# EAGLE design ottoesp_wrover (EAGLE 9.6.2)
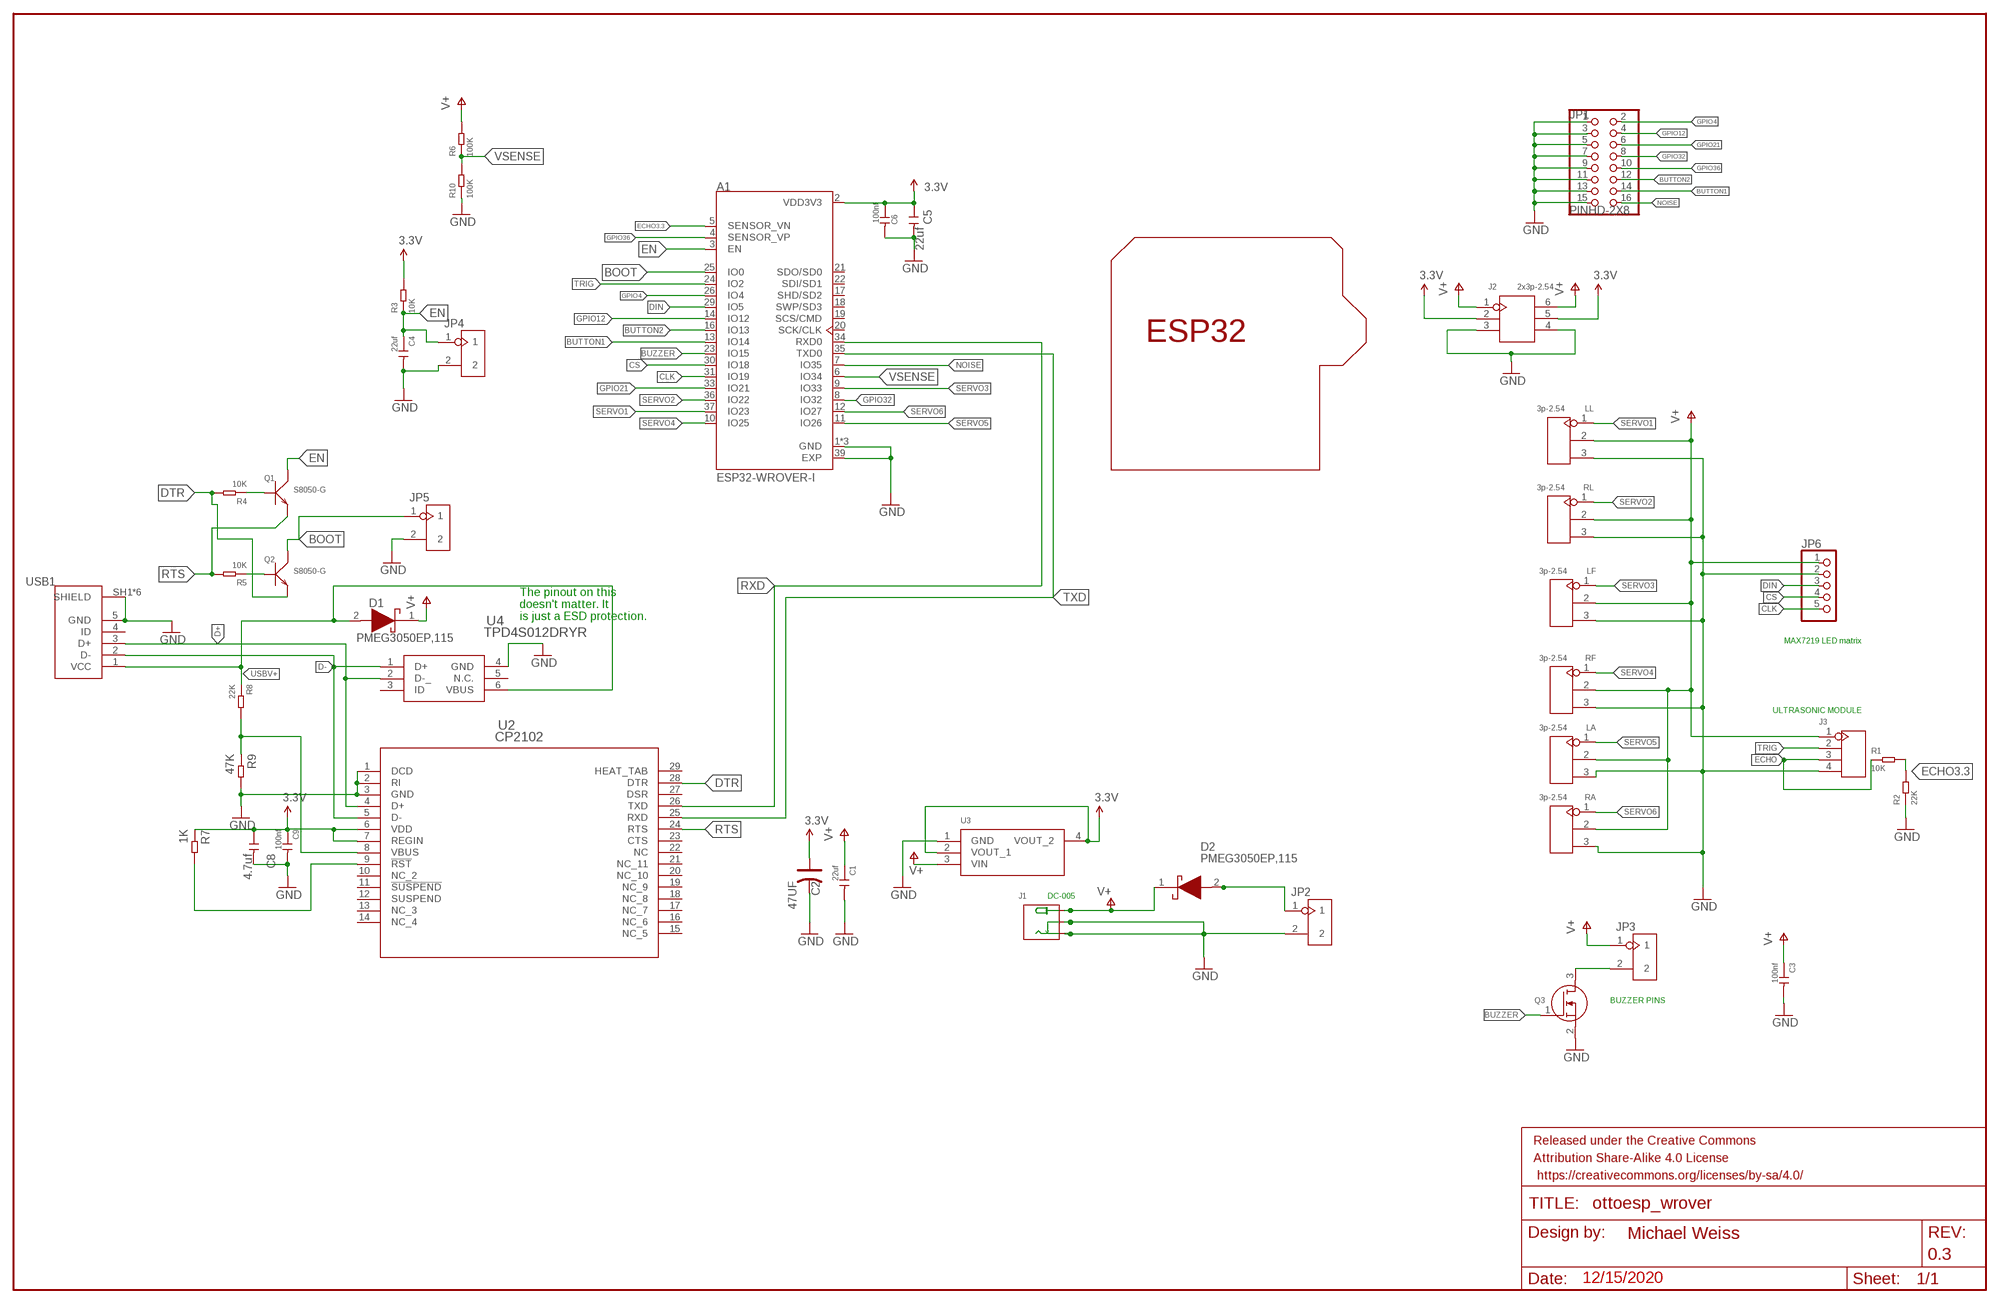
[diagram p0: schematic, sheet 1]

## Parts
A1  ESP32-WROVER-I  [XCVR_ESP32-WROVER-I]
C1  22uf  CERAMIC-22UF-6.3V-20%-X5R(0805)  [C0805]
C2  47UF  ALUMINUM-SMD-47UF-25V(D6.3-H5.3MM)  [ELECTRO-SMD-C-6MM]
C3  100nf  CERAMIC-100NF-50V-20%-X5R(0805)  [C0805]
C4  22uf  CERAMIC-22UF-6.3V-20%-X5R(0805)  [C0805]
C5  22uf  CERAMIC-22UF-6.3V-20%-X5R(0805)  [C0805]
C6  100nf  CERAMIC-100NF-50V-20%-X5R(0805)  [C0805]
C8  4.7uf  CERAMIC-4.7UF-25V-10%-X5R(0805)  [C0805]
C9  100nf  CERAMIC-100NF-50V-20%-X5R(0805)  [C0805]
D1  PMEG3050EP,115  [PMEG3050EP115]
D2  PMEG3050EP,115  [PMEG3050EP115]
FRAME1  FRAME-LEDGERMISHAFARMS  [MISHAFARMS]
J1  DC-005  CONN-POWER-JACK-2.1MM(DC-005)  [DCJ3P-14.2X11.0X9.0MM]
J2  2x3p-2.54  DIP-BLACK-MALE-HEADER(2X3P-2.54）-2.54  [H2X3-2.54]
J3  4p-2.54  DIP-BLACK-MALE-HEADER-VERT(4P-2.54)  [H4-2.54]
JP1  PINHD-2X8  [2X08]
JP2  2p-2.54  DIP-BLACK-MALE-HEADER-VERT(2P-2.54)  [H2-2.54]
JP3  2p-2.54  DIP-BLACK-MALE-HEADER-VERT(2P-2.54)  [H2-2.54]
JP4  2p-2.54  DIP-BLACK-MALE-HEADER-VERT(2P-2.54)  [H2-2.54]
JP5  2p-2.54  DIP-BLACK-MALE-HEADER-VERT(2P-2.54)  [H2-2.54]
JP6  PINHD-1X5  [1X05]
LA  3p-2.54  DIP-BLACK-MALE-HEADER-VERT(3P-2.54)  [H3-2.54]
LF  3p-2.54  DIP-BLACK-MALE-HEADER-VERT(3P-2.54)  [H3-2.54]
LL  3p-2.54  DIP-BLACK-MALE-HEADER-VERT(3P-2.54)  [H3-2.54]
Q1  S8050-G  SMD-TRANSISTORS-NPN-25V-500MW-S8050(SOT-23)  [SOT-23]
Q2  S8050-G  SMD-TRANSISTORS-NPN-25V-500MW-S8050(SOT-23)  [SOT-23]
Q3  CJ2302  2N7002NXAKR  [SOT95P230X110-3N]
R1  10K  SMD-RES-10K-1%-1/4W(0805)  [R0805]
R2  22K  SMD-RES-22K-5%-1/4W(0805)  [R0805]
R3  10K  SMD-RES-10K-1%-1/4W(0805)  [R0805]
R4  10K  SMD-RES-10K-1%-1/4W(0805)  [R0805]
R5  10K  SMD-RES-10K-1%-1/4W(0805)  [R0805]
R6  100K  SMD-RES-100K-.5%-1/10W(0805)  [R0805]
R7  1K  SMD-RES-1K-1%-1/8W(0805)  [R0805]
R8  22K  SMD-RES-22K-5%-1/4W(0805)  [R0805]
R9  47K  SMD-RES-47K-1%-1/4W(0805)  [R0805]
R10  100K  SMD-RES-100K-.5%-1/10W(0805)  [R0805]
RA  3p-2.54  DIP-BLACK-MALE-HEADER-VERT(3P-2.54)  [H3-2.54]
RF  3p-2.54  DIP-BLACK-MALE-HEADER-VERT(3P-2.54)  [H3-2.54]
RL  3p-2.54  DIP-BLACK-MALE-HEADER-VERT(3P-2.54)  [H3-2.54]
U2  CP2102  [QFN28N5X5-0P5P]
U3  CJA1117B-3.3-SOT89  AP2114H-3.3TRG1  [SOT230P700X180-4N]
U4  TPD4S012DRYR  [TPD4S012DRYR]
U$2  ESP32_SHIELDSMALL  [ESP32_ARDUINOSHIELDSMALL]
USB1  ZX62-B-5PA  ZX62-B-5PA(33)  [HRS_ZX62-B-5PA(33)]

## Nets
3.3V [3.3V]: A1.2(VDD3V3) C2.+ C5.1 C6.1 C8.1 C9.1 J2.2 J2.5 R3.2 R7.1 U2.6(VDD) U2.7(REGIN) U3.2(VOUT_1) U3.4(VOUT_2)
BOOT: A1.25(IO0) JP5.1 Q2.3(C)
BUTTON1: A1.13(IO14) JP1.14
BUTTON2: A1.16(IO13) JP1.12
BUZZER: A1.23(IO15) Q3.1(G)
CLK: A1.31(IO19) JP6.5
CS: A1.30(IO18) JP6.4
D+: U2.4(D+) U4.2(D-_) USB1.3(D+)
D-: U2.5(D-) U4.1(D+) USB1.2(D-)
DIN: A1.29(IO5) JP6.3
DTR: Q2.2(E) R4.2 U2.28(DTR)
ECHO: J3.3 R1.1
ECHO3.3: A1.5(SENSOR_VN) R1.2 R2.2
EN: A1.3(EN) C4.1 JP4.1 Q1.3(C) R3.1
GND: A1.1(GND) A1.15(GND) A1.38(GND) A1.39(EXP) C1.2 C2.- C3.2 C4.2 C5.2 C6.2 C8.2 C9.2 J1.-1B(-) J1.-1T(-) J1.-2(CDN) J1.-2B(CDN) J2.3 J2.4 J3.4 JP1.1 JP1.3 JP1.5 JP1.7 JP1.9 JP1.11 JP1.13 JP1.15 JP2.2 JP4.2 JP5.2 JP6.2 LA.3 LF.3 LL.3 Q3.2(S) R2.1 R9.2 R10.1 RA.3 RF.3 RL.3 U2.1(DCD) U2.2(RI) U2.3(GND) U3.1(GND) U4.4(GND) USB1.5(GND) USB1.SH1(SHIELD) USB1.SH2(SHIELD) USB1.SH3(SHIELD) USB1.SH4(SHIELD) USB1.SH5(SHIELD) USB1.SH6(SHIELD)
GPIO4: A1.26(IO4) JP1.2
GPIO12: A1.14(IO12) JP1.4
GPIO21: A1.33(IO21) JP1.6
GPIO32: A1.8(IO32) JP1.8
GPIO36: A1.4(SENSOR_VP) JP1.10
N$3: JP3.2 Q3.3(D)
N$4: Q1.1(B) R4.1
N$5: Q2.1(B) R5.1
N$6: R7.2 U2.9(!RST)
N$7: R8.2 R9.1 U2.8(VBUS)
N$11 [V+]: D2.2(A) JP2.1
NOISE: A1.7(IO35) JP1.16
RTS: Q1.2(E) R5.2 U2.24(RTS)
RXD: A1.34(RXD0) U2.26(TXD)
SERVO1: A1.37(IO23) LL.1
SERVO2: A1.36(IO22) RL.1
SERVO3: A1.9(IO33) LF.1
SERVO4: A1.10(IO25) RF.1
SERVO5: A1.11(IO26) LA.1
SERVO6: A1.12(IO27) RA.1
TRIG: A1.24(IO2) J3.2
TXD: A1.35(TXD0) U2.25(RXD)
USBV+: D1.2(A) R8.1 U4.6(VBUS) USB1.1(VCC)
V+ [V+]: C1.1 C3.1 D1.1(K) D2.1(K) J1.+B(+) J1.+T(+) J2.1 J2.6 J3.1 JP3.1 JP6.1 LA.2 LF.2 LL.2 R6.2 RA.2 RF.2 RL.2 U3.3(VIN)
VSENSE: A1.6(IO34) R6.1 R10.2
Unconnected: A1.17(SHD/SD2) A1.18(SWP/SD3) A1.19(SCS/CMD) A1.20(SCK/CLK) A1.21(SDO/SD0) A1.22(SDI/SD1) U2.10(NC_2) U2.11(!SUSPEND) U2.12(SUSPEND) U2.13(NC_3) U2.14(NC_4) U2.15(NC_5) U2.16(NC_6) U2.17(NC_7) U2.18(NC_8) U2.19(NC_9) U2.20(NC_10) U2.21(NC_11) U2.22(NC) U2.23(CTS) U2.27(DSR) U2.29(HEAT_TAB) U4.3(ID) U4.5(N.C.) USB1.4(ID)

## Notes on the sheet
- The pinout on this
  doesn't matter. It
  is just a ESD protection.
- MAX7219 LED matrix
- ULTRASONIC MODULE
- BUZZER PINS
- 12/15/2020

## Library data of the parts
A1 = SamacSys_Parts:ESP32-WROVER-I: ESP32 WROVER-IB; DESCRIPTION: ESP-32 WROVER; MANUFACTURER_NAME: Espressif Systems; MANUFACTURER_PART_NUMBER: ESP32-WROVER-IE(M213EH2864UH3Q0); MOUSER_PART_NUMBER: 356-ESP32WRVIE2864UC; MOUSER_PRICE-STOCK: https://www.mouser.com/ProductDetail/Espressif-Systems/ESP32-WROVER-IEM213EH2864UH3Q0/?qs=%2Fha2pyFadugKGKyA%252BZerg02KWjt%252BDkpx3J9PekcVrnwUVjlziX0fZwpevaFLQ9DtOpRR%252BtWJ7uE%3D
C1 C4 C5 = SamacSys_Parts:CERAMIC-22UF-6.3V-20%-X5R(0805): Capacitor 22uf 20% SMD 0805; DESCRIPTION: Capacitor 22uf 20% SMD 0805; MANUFACTURER_NAME: KEMET; MANUFACTURER_PART_NUMBER: C1206C226M9PACTU; MOUSER_PART_NUMBER: 80-C1206C226M9P; MOUSER_PRICE-STOCK: https://www.mouser.com/ProductDetail/KEMET/C1206C226M9PACTU/?qs=e7A2guvi5TDfGn1mCprQAw%3D%3D
C2 = SamacSys_Parts:ALUMINUM-SMD-47UF-25V(D6.3-H5.3MM): Electrolytic Capacitors - SMD 25 Volts 47uF 20% 6.3x5.3; DESCRIPTION: Electrolytic Capacitors - SMD 25 Volts 47uF 20% 6.3x5.3; MANUFACTURER_NAME: Lelon; MANUFACTURER_PART_NUMBER: VE-470M1ETR-0605; MOUSER_PART_NUMBER: 140-VE470M1ETR0605; MOUSER_PRICE-STOCK: https://www.mouser.com/ProductDetail/Lelon/VE-470M1ETR-0605/?qs=%2Fha2pyFadujyJfKDrJB4ynLbAx5NeyBtku0SVNtXu37UWxAjl85WnQ%3D%3D
C3 C6 C9 = SamacSys_Parts:CERAMIC-100NF-50V-20%-X5R(0805): Capacitor 100nf 20% SMD 0805; DESCRIPTION: Capacitor 100nf 20% SMD 0805; MANUFACTURER_NAME: Yageo; MANUFACTURER_PART_NUMBER: CC0805ZRY5V9BB104; MOUSER_PART_NUMBER: 603-CC805ZRY5V9BB104; MOUSER_PRICE-STOCK: https://www.mouser.com/ProductDetail/Yageo/CC0805ZRY5V9BB104/?qs=%2Fha2pyFaduhNpscxq1sti0Qw6N3MgEmHt2LRq9SOD7Ebj2OJEh4r7aJUxnG3Kkh7
C8 = SamacSys_Parts:CERAMIC-4.7UF-25V-10%-X5R(0805): 302010146; DESCRIPTION: Capacitor 4.7uf 10% SMD 0805; MANUFACTURER_NAME: Walsin; MANUFACTURER_PART_NUMBER: 0805X475M250CT; MOUSER_PART_NUMBER: 791-0805X475M250CT; MOUSER_PRICE-STOCK: https://www.mouser.com/ProductDetail/Walsin/0805X475M250CT/?qs=%2Fha2pyFadugovbtJ4IPO2aI5%2FHfN6czWOLxzJ368rfolfgZFQZPK8JJR9MicoCMy
D1 D2 = SamacSys_Parts:PMEG3050EP,115: NXP PMEG3050EP,115 SMT Schottky Diode, 30V 5A, 2-Pin SOD-128 Source: Datasheet; DESCRIPTION: NXP PMEG3050EP,115 SMT Schottky Diode, 30V 5A, 2-Pin SOD-128; HEIGHT: 1mm; MANUFACTURER_NAME: Nexperia; MANUFACTURER_PART_NUMBER: PMEG3050EP,115; MOUSER_PART_NUMBER: 771-PMEG3050EP115; MOUSER_PRICE-STOCK: https://www.mouser.co.uk/ProductDetail/Nexperia/PMEG3050EP115?qs=GcY6OjH1zdmnjQ%2FhUT5aOA%3D%3D
FRAME1 = SamacSys_Parts:FRAME-LEDGER: Schematic Frame - Ledger Standard 11x14 US Ledger frame; DESIGNER: Michael Weiss; REV: 0.3
J1 = OPL_Connector:CONN-POWER-JACK-2.1MM(DC-005): Seeed SKU 320120003 - DIP Black DC Jack 2.1MM MPN: DC-005 Important Notes: This part requires milling slots. Please make sure layer 46 Milling is included in the profile or outline layer when exporting Gerber files. Alternatively, you can use the built-in Seeed Fusion CAM file. Find it under Third-Party CAM files. Seeed Fusion PCBA OPL <https://www.seeedstudio.com/opl.html> Order PCB/PCBA Now <https://www.seeedstudio.com/fusion_pcb.html> www.seeedstudio.com; MPN: DC-005
J2 = SamacSys_Parts:DIP-BLACK-MALE-HEADER(2X3P-2.54）: 320020077; MANUFACTURER_PART_NUMBER: P125-12A1BS116A1
J3 = SamacSys_Parts:DIP-BLACK-MALE-HEADER-VERT(4P-2.54): 320020017; MANUFACTURER_PART_NUMBER: P125-1104A0BS116A1
JP1 = Connector:PINHD-2X8: PIN HEADER; CATEGORY: CONNECTOR; SUB-CATEGORY: PIN-HEADER
JP2-JP5 = SamacSys_Parts:DIP-BLACK-MALE-HEADER-VERT(2P-2.54): 320020016; MANUFACTURER_PART_NUMBER: P125-1102A0BS116A1
JP6 = SamacSys_Parts:PINHD-1X5: PIN HEADER
LA LF LL RA RF RL = SamacSys_Parts:DIP-BLACK-MALE-HEADER-VERT(3P-2.54): 320020079
Q1 Q2 = SamacSys_Parts:SMD-TRANSISTORS-NPN-25V-500MW-S8050(SOT-23): NPN transistor; MANUFACTURER_PART_NUMBER: SS8050-G; MOUSER_PART_NUMBER: 750-SS8050-G
Q3 = SamacSys_Parts:2N7002NXAKR: NEXPERIA - 2N7002NXAKR - MOSFET Transistor, Trench, N Channel, 190 mA, 60 V, 3 ohm, 10 V, 1.6 V Source: Datasheet; DESCRIPTION: NEXPERIA - 2N7002NXAKR - MOSFET Transistor, Trench, N Channel, 190 mA, 60 V, 3 ohm, 10 V, 1.6 V; HEIGHT: 1.1mm; MANUFACTURER_NAME: Nexperia; MANUFACTURER_PART_NUMBER: 2N7002NXAKR; MOUSER_PART_NUMBER: 771-2N7002NXAKR; MOUSER_PRICE-STOCK: https://www.mouser.co.uk/ProductDetail/Nexperia/2N7002NXAKR/?qs=%252B6g0mu59x7JoAsZYPFXqhw%3D%3D
R1 R3-R5 = SamacSys_Parts:SMD-RES-10K-1%-1/4W(0805): Resistor 10K 1%; DESCRIPTION: Resistor 10K 1% SMD 0805; MANUFACTURER_NAME: KOA Speer; MANUFACTURER_PART_NUMBER: RK73H2ATTD1002F; MOUSER_PART_NUMBER: 660-RK73H2ATTD1002F; MOUSER_PRICE-STOCK: https://www.mouser.com/ProductDetail/KOA-Speer/RK73H2ATTD1002F/?qs=tLTLU8dkiwvc%2FyU3ERoqnw%3D%3D
R2 R8 = SamacSys_Parts:SMD-RES-22K-5%-1/4W(0805): Resistor 22K 5%; DESCRIPTION: Resistor 22K 5% SMD 0805; MANUFACTURER_NAME: KOA Speer; MANUFACTURER_PART_NUMBER: RK73B2ATTD223J; MOUSER_PART_NUMBER: 660-RK73B2ATTD223J; MOUSER_PRICE-STOCK: https://www.mouser.com/ProductDetail/KOA-Speer/RK73B2ATTD223J/?qs=rx%252BqewZzWUffEp6AgUqu%252Bg%3D%3D
R6 R10 = SamacSys_Parts:SMD-RES-100K-.5%-1/10W(0805): Resistor 100K 0.5%; DESCRIPTION: Resistor 100K 0.5% SMD 0805; MANUFACTURER_NAME: Susumu; MANUFACTURER_PART_NUMBER: RR1220P-104-D; MOUSER_PART_NUMBER: 754-RR1220P-104D; MOUSER_PRICE-STOCK: https://www.mouser.com/ProductDetail/Susumu/RR1220P-104-D/?qs=%2Fha2pyFadujCPgNeBjWI96%252BroUq1pkWN2MbsYos73Tx95ayAVluOxg%3D%3D
R7 = SamacSys_Parts:SMD-RES-1K-1%-1/8W(0805): Resistor 1K 1%; DESCRIPTION: Resistor 1K 1% SMD 0805; MANUFACTURER_NAME: Vishay / Dale; MANUFACTURER_PART_NUMBER: CRCW08051K00FKEAC; MOUSER_PART_NUMBER: 71-CRCW08051K00FKEAC; MOUSER_PRICE-STOCK: https://www.mouser.com/ProductDetail/Vishay-Dale/CRCW08051K00FKEAC/?qs=%2Fha2pyFadui6t5gBae62od441kk8GmyGFVmxEidNFq5xUBgAyCVXXx2D0V55RqKK
R9 = SamacSys_Parts:SMD-RES-47K-1%-1/4W(0805): Resistor 47K 1%; DESCRIPTION: Resistor 47K 1% SMD 0805; MANUFACTURER_NAME: KOA Speer; MANUFACTURER_PART_NUMBER: RK73H2ATTD4702F; MOUSER_PART_NUMBER: 660-RK73H2ATTD4702F; MOUSER_PRICE-STOCK: https://www.mouser.com/ProductDetail/KOA-Speer/RK73H2ATTD4702F/?qs=%2Fha2pyFadujLLpodnepgt4r0Qw%2FLlQaBaDxSVsal6zzxootuMZ88MQ%3D%3D
U2 = SamacSys_Parts:CP2102: USB to UART; DESCRIPTION: USB-UART; MANUFACTURER_NAME: Silicon Labs; MANUFACTURER_PART_NUMBER: CP2102N-A02-GQFN28R; MOUSER_PART_NUMBER: 634-CP2102NA02QFN28R; MOUSER_PRICE-STOCK: https://www.mouser.com/ProductDetail/Silicon-Labs/CP2102N-A02-GQFN28R/?qs=u16ybLDytRag4qKvSH3fTw%3D%3D
U3 = SamacSys_Parts:AP2114H-3.3TRG1: 1A 3.3V Low Noise LDO Regulator SOT223 DiodesZetex AP2114H-3.3TRG1, LDO Voltage Regulator, 1 (Min)A, 3.3 V +/-1.5%, 2.5 6 Vin, 3-Pin SOT-223 Source: Datasheet; DESCRIPTION: 1A 3.3V Low Noise LDO Regulator SOT223 DiodesZetex AP2114H-3.3TRG1, LDO Voltage Regulator, 1 (Min)A, 3.3 V +/-1.5%, 2.5 6 Vin, 3-Pin SOT-223; HEIGHT: 1.8mm; MANUFACTURER_NAME: Diodes Inc.; MANUFACTURER_PART_NUMBER: AP2114H-3.3TRG1; MOUSER_PART_NUMBER: 621-AP2114H-3.3TRG1; MOUSER_PRICE-STOCK: https://www.mouser.co.uk/ProductDetail/Diodes-Incorporated/AP2114H-33TRG1?qs=x6A8l6qLYDDSG%2FfwzcsOhw%3D%3D
U4 = SamacSys_Parts:TPD4S012DRYR: ESD Suppressors / TVS Diodes 4Ch USB ESD Solution w/ Pwr Clamp Source: Datasheet <https://www.ti.com/lit/gpn/TPD4S012>; DESCRIPTION: ESD Suppressors / TVS Diodes 4Ch USB ESD Solution w/ Pwr Clamp; HEIGHT: 0.6mm; MANUFACTURER_NAME: Texas Instruments; MANUFACTURER_PART_NUMBER: TPD4S012DRYR; MOUSER_PART_NUMBER: 595-TPD4S012DRYR; MOUSER_PRICE-STOCK: https://www.mouser.co.uk/ProductDetail/Texas-Instruments/TPD4S012DRYR?qs=XGzIaZb%2FFYJve%2FbrCpoVgg%3D%3D
U$2 = ottoesp:ESP32_SHIELDSMALL: Board pattern for Otto
USB1 = SamacSys_Parts:ZX62-B-5PA(33): ZX Series 5 Position Right Angle PCB Wire Micro B USB Plug; DESCRIPTION: USB Micro B female connector; MANUFACTURER_NAME: Hirose Connector; MANUFACTURER_PART_NUMBER: ZX62-B-5PA(33); MOUSER_PART_NUMBER: 798-ZX62-B-5PA33; MOUSER_PRICE-STOCK: https://www.mouser.com/ProductDetail/Hirose-Connector/ZX62-B-5PA33/?qs=%2Fha2pyFaduhiSQl2TrshNN4h5tYLcCq4%252B%2FDj%2FzhIV4TUsZmrT6v6qg%3D%3D

## Net classes
1 3.3V: width 0.406 mm
2 V+: width 1.016 mm

## Board
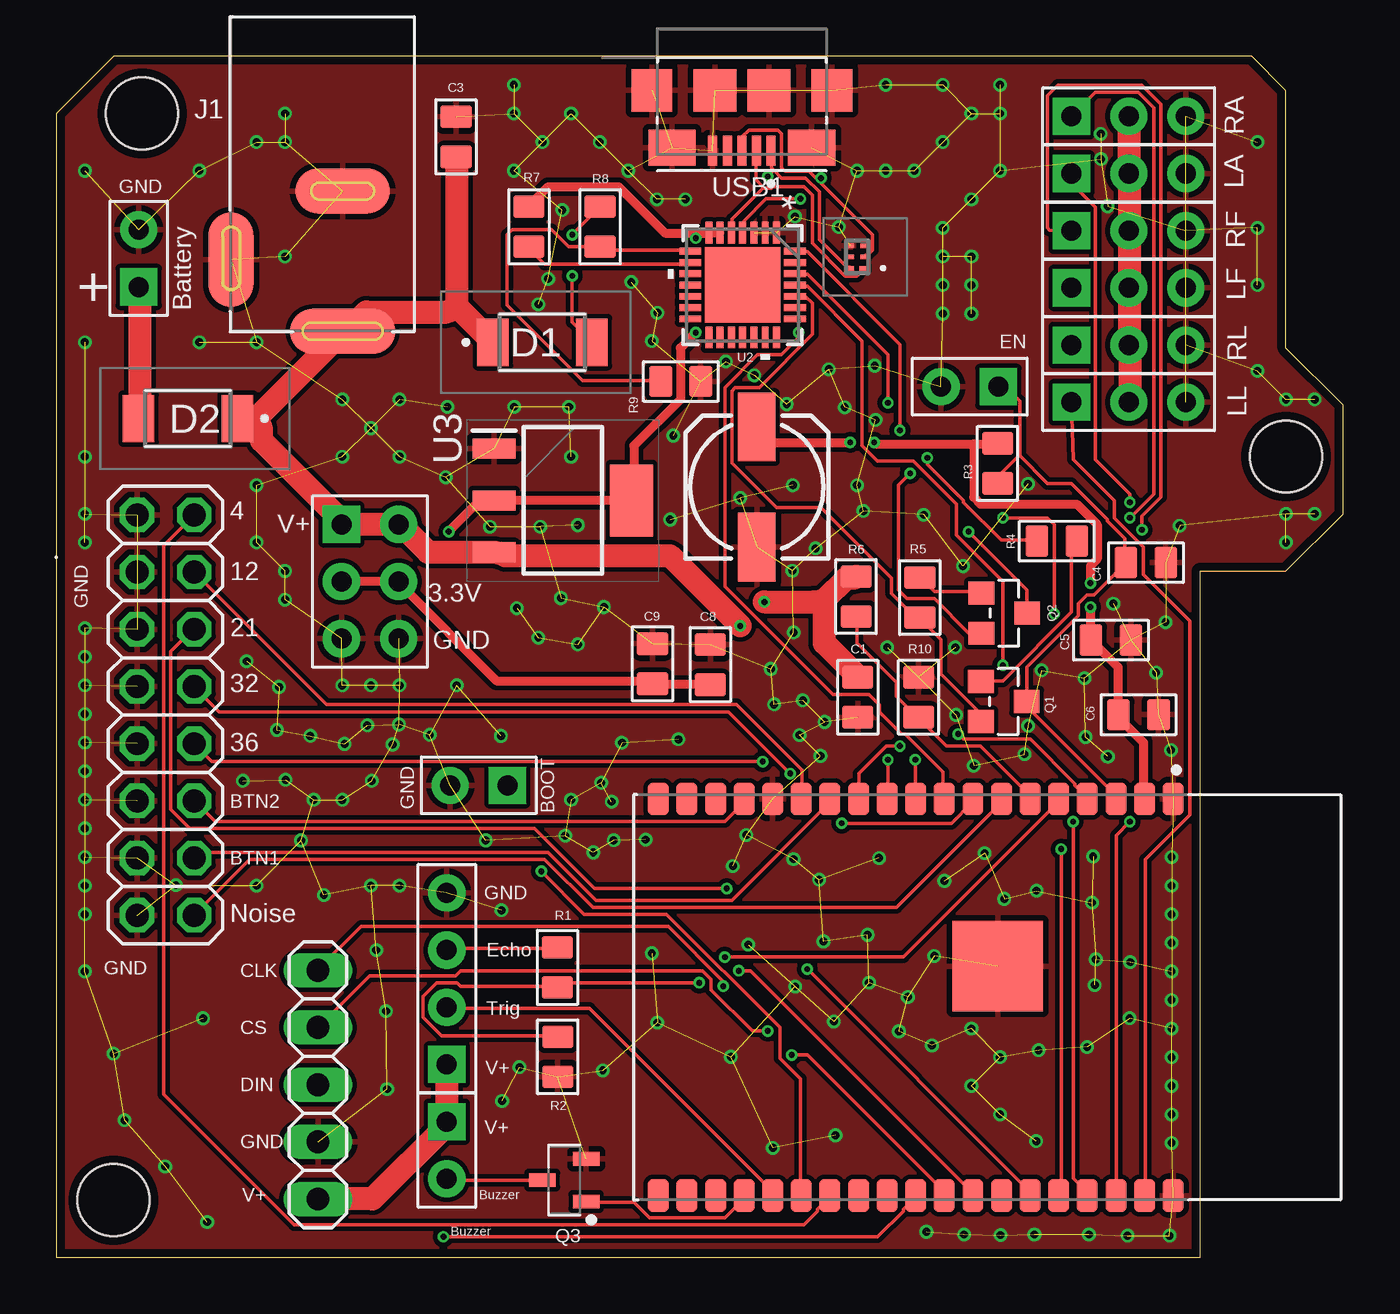
[diagram p1: board, top side]
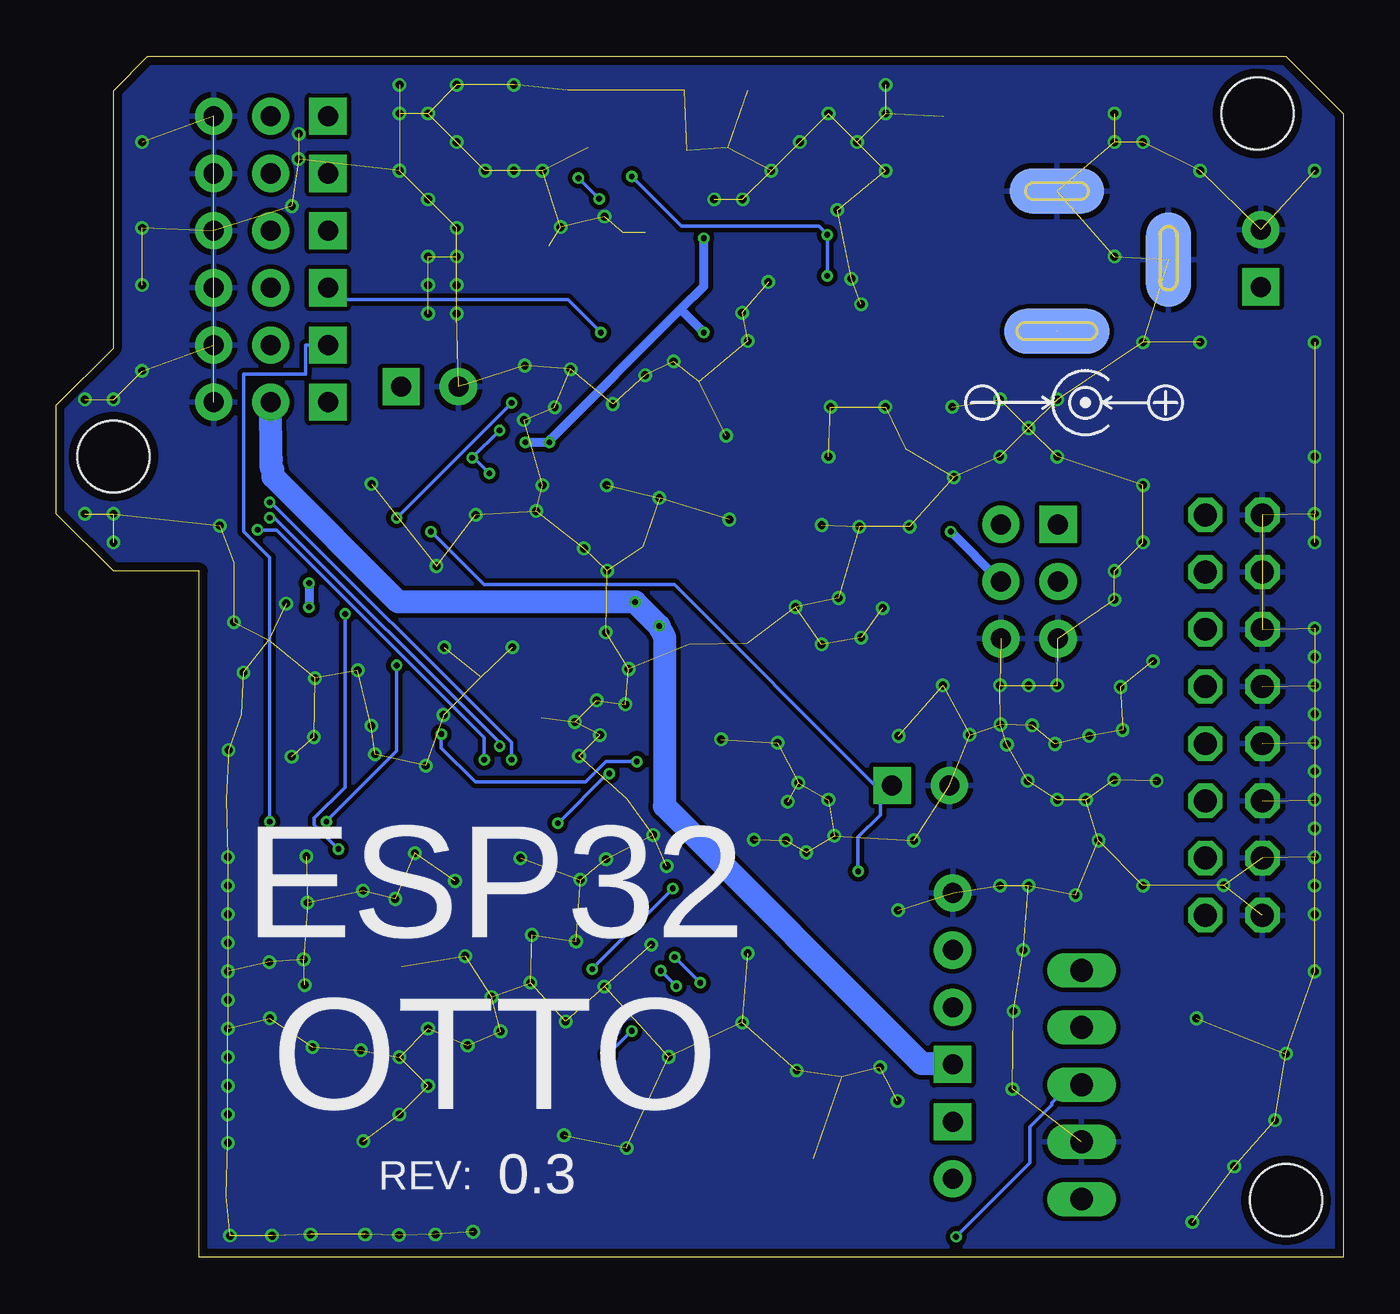
[diagram p2: board, bottom side, seen from below]

Size 57.15 x 53.34 mm. Coordinates in mm from the lower left corner, seen from the top.
Copper layers (1*16): Top 0.035559375mm / dielectric 1.6mm / Bottom 0.035559375mm
Design rules "oshpark-2layer": minimum track width 6mil, minimum drill 10mil, track to track 6mil, track to pad 6mil, pad to pad 6mil, via to via 6mil, smd to smd 6mil, copper to edge 15mil, drill to drill 6mil, minimum pad ring 5mil, minimum via ring 5mil, stop-mask expansion 2.5mil, vias tented up to drill 0mil, thermal gap 10mil

### Footprints (pad centres in the part's own frame; a part is rotated, then mirrored left to right if it is on the bottom)
XCVR_ESP32-WROVER-I = smd 1.45 x 0.93: 1 -8.81,8.26; 2 -8.81,6.99; 3 -8.81,5.72; 4 -8.81,4.45; 5 -8.81,3.18; 6 -8.81,1.91; 7 -8.81,0.64; 8 -8.81,-0.63; 9 -8.81,-1.9; 10 -8.81,-3.17; 11 -8.81,-4.44; 12 -8.81,-5.71; 13 -8.81,-6.98; 14 -8.81,-8.25; 15 -8.81,-9.52; 16 -8.81,-10.79; 17 -8.81,-12.06; 18 -8.81,-13.33; 19 -8.81,-14.6; 20 8.81,-14.6; 21 8.81,-13.33; 22 8.81,-12.06; 23 8.81,-10.79; 24 8.81,-9.52; 25 8.81,-8.25; 26 8.81,-6.98; 27 8.81,-5.71; 28 8.81,-4.44; 29 8.81,-3.17; 30 8.81,-1.9; 31 8.81,-0.63; 32 8.81,0.64; 33 8.81,1.91; 34 8.81,3.18; 35 8.81,4.45; 36 8.81,5.72; 37 8.81,6.99; 38 8.81,8.26 | smd 4 x 4: 39 -1.38,0.47
C0805 = smd 1.397 x 1.016: 1 0,0.889; 2 0,-0.889
ELECTRO-SMD-C-6MM = smd 3.048 x 1.651: + 2.667,0; - -2.667,0
PMEG3050EP115 = smd 1.4 x 2.1: 1 -2.2,0; 2 2.2,0
DCJ3P-14.2X11.0X9.0MM = smd 2 x 4.7 bottom: +B 3.175,0 | smd 2 x 4.7: +T 3.175,0 | smd 2 x 4.2 bottom: -1B -3.048,0 | smd 2 x 4.2: -1T -3.048,0 | smd 4.2 x 2: -2 0,-4.953 | smd 4.2 x 2 bottom: -2B 0,-4.953
H2X3-2.54 = drill 0.889 pad 1.651 square: 1 -1.27,2.54 | drill 0.889 pad 1.651: 2 -1.27,0; 3 -1.27,-2.54; 4 1.27,-2.54; 5 1.27,0; 6 1.27,2.54
H4-2.54 = drill 0.889 pad 1.651 square: 1 0,3.81 | drill 0.889 pad 1.651: 2 0,1.27; 3 0,-1.27; 4 0,-3.81
2X08 = drill 1.016 octagon: 1 -8.89,-1.27; 2 -8.89,1.27; 3 -6.35,-1.27; 4 -6.35,1.27; 5 -3.81,-1.27; 6 -3.81,1.27; 7 -1.27,-1.27; 8 -1.27,1.27; 9 1.27,-1.27; 10 1.27,1.27; 11 3.81,-1.27; 12 3.81,1.27; 13 6.35,-1.27; 14 6.35,1.27; 15 8.89,-1.27; 16 8.89,1.27
H2-2.54 = drill 0.889 pad 1.651 square: 1 0,1.27 | drill 0.889 pad 1.651: 2 0,-1.27
1X05 = drill 1.016 long: 1 -5.08,0; 2 -2.54,0; 3 0,0; 4 2.54,0; 5 5.08,0
H3-2.54 = drill 0.889 pad 1.651 square: 1 0,2.54 | drill 0.889 pad 1.651: 2 0,0; 3 0,-2.54
SOT-23 = smd 1.016 x 1.143: 1 -0.889,-1.016; 2 0.889,-1.016; 3 0,1.016
SOT95P230X110-3N = smd 1.18 x 0.609: 1 -0.975,0.95; 2 -0.975,-0.95; 3 0.975,0
R0805 = smd 1.397 x 1.016: 1 0,0.889; 2 0,-0.889
QFN28N5X5-0P5P = smd 0.965 x 0.305: 1 -2.324,1.5; 2 -2.324,1; 3 -2.324,0.5; 4 -2.324,0; 5 -2.324,-0.5; 6 -2.324,-1; 7 -2.324,-1.5; 15 2.324,-1.5; 16 2.324,-1; 17 2.324,-0.5; 18 2.324,0; 19 2.324,0.5; 20 2.324,1; 21 2.324,1.5 | smd 0.305 x 0.965: 8 -1.5,-2.324; 9 -1,-2.324; 10 -0.5,-2.324; 11 0,-2.324; 12 0.5,-2.324; 13 1,-2.324; 14 1.5,-2.324; 22 1.5,2.324; 23 1,2.324; 24 0.5,2.324; 25 0,2.324; 26 -0.5,2.324; 27 -1,2.324; 28 -1.5,2.324 | smd 3.353 x 3.353: 29 0,0
SOT230P700X180-4N = smd 1.9 x 0.9: 1 -3.05,2.3; 2 -3.05,0; 3 -3.05,-2.3 | smd 1.9 x 3.2: 4 3.05,0
TPD4S012DRYR = smd 0.35 x 0.2: 1 -0.275,0.5 | smd 0.3 x 0.2: 2 -0.3,0; 3 -0.3,-0.5; 4 0.3,-0.5; 5 0.3,0; 6 0.3,0.5
ESP32_ARDUINOSHIELDSMALL = hole 3.2: -13.97,33.02; 36.83,17.78; -15.24,-15.24
HRS_ZX62-B-5PA(33) = smd 0.4 x 1.35: 1 -1.3,2.675; 2 -0.65,2.675; 3 0,2.675; 4 0.65,2.675; 5 1.3,2.675 | smd 2.1 x 1.6: SH1 -3.1,2.55; SH6 3.1,2.55 | smd 1.8 x 1.9: SH2 -4,0; SH5 4,0 | smd 1.9 x 1.9: SH3 -1.2,0; SH4 1.2,0

### Placement (x,y rotation side)
A1  41.34,11.55 270 top
C1  35.59,24.88 0 top
C2  31.11,34.21 90 top
C3  17.75,49.76 180 top
C4  48.39,30.86 90 top
C5  46.84,27.42 90 top
C6  48.06,24.1 90 top
C8  29.04,26.32 180 top
C9  26.48,26.36 180 top
D1  21.59,40.64 0 top
D2  5.85,37.25 180 top
FRAME1  38.66,4.29 180 top
J1  12.72,44.31 270 top
J2  13.93,30.01 0 top
J3  17.34,12.38 180 top
JP1  4.86,24.08 270 top
JP2  3.66,44.37 180 top
JP3  17.34,4.76 0 top
JP4  40.56,38.67 270 top
JP5  18.76,20.96 270 top
JP6  11.62,7.67 90 top
LA  47.63,48.14 90 top
LF  47.63,43.06 90 top
LL  47.63,37.98 90 top
Q1  42.08,24.69 270 top
Q2  42.1,28.61 270 top
Q3  22.56,3.43 180 top
R1  22.25,12.87 0 top
R2  22.27,8.9 180 top
R3  41.8,35.26 180 top
R4  44.43,31.81 270 top
R5  38.35,29.31 0 top
R6  35.52,29.35 180 top
R7  20.99,45.77 0 top
R8  24.15,45.77 0 top
R9  27.73,38.9 90 top
R10  38.29,24.88 0 top
RA  47.63,50.68 90 top
RF  47.63,45.6 90 top
RL  47.63,40.52 90 top
U2  30.48,43.18 270 top
U3  22.49,33.61 0 top
U4  35.57,44.43 180 top
U$2  17.78,17.78 0 top
USB1  30.45,51.82 180 top

### Tracks (layer width: path | path; a pad name or v marks a point on that pad's centre or on a via)
3.3V  (via drill 0.25)
  Top 0.305: 29.46,45.49 U2.6
  Top 0.406: C8.1 29.01,25.45 26.49,25.45 C9.1 26.34,25.6 19.56,25.6 15.21,29.95 J2.5 15.06,30.02 12.7,30.02 J2.2 | v17.42,32.23 18.8,33.6 19.25,33.6 U3.2 19.48,33.6 25.5,33.6 U3.4 25.65,33.76 25.65,36.04 27.71,38.1 27.71,40.39 v28.4,41.07 | A1.2 48.28,20.42 48.28,22.86 47.22,23.93 C6.1 47.14,24.16 47.14,26.21 46,27.36 C5.1 45.92,27.58 v45.92,28.88 | 29.46,45.49 29.01,45.49 U2.7 28.78,45.49 28.4,45.49 | 28.4,45.49 27.03,45.49 24.97,47.55 21.84,47.55 21.01,46.71 R7.1 | 40.74,36.12 36.4,36.12 v36.32,36.2 | 40.74,36.12 41.73,36.12 R3.2 | v35.25,36.2 31.75,36.2 31.14,36.8 C2.+ | v28.4,45.26 28.4,45.49 | v45.92,29.95 45.92,30.71 46.23,31.01 46.23,32.54 45.31,33.45 41.05,33.45 40.74,33.76 40.74,36.12
  Bottom 0.406: v17.42,32.23 15.21,30.02 J2.5 | v36.32,36.2 v35.25,36.2 35.18,36.35 29.43,42.1 | v28.4,45.26 28.4,43.13 29.43,42.1 | v45.92,29.95 v45.92,28.88 | 29.43,42.1 v28.4,41.07
BOOT  (via drill 0.25)
  Top 0.152: v40.51,32.23 43.1,29.64 43.1,28.65 Q2.3 | v21.54,17.14 23.44,15.24 27.1,15.24 32.13,10.21 32.13,8.84 33.05,7.92 33.05,2.74 A1.25
  Bottom 0.152: v40.51,32.23 38.15,29.87 29.69,29.87 20.85,21.03 20.55,21.03 | 20.55,21.03 20.09,21.03 JP5.1 20.55,21.03 | v21.54,17.14 21.54,18.67 20.55,19.66 20.55,21.03
BUTTON1
  Top 0.152: A1.13 34.34,20.34 34.34,20.19 30,15.85 23.98,15.85 21.84,17.98 6.38,17.98 6.15,17.75 JP1.14
BUTTON2
  Top 0.152: A1.16 30.53,20.34 30.53,20.19 29.69,19.36 7.06,19.36 6.15,20.27 JP1.12
BUZZER
  Top 0.152: Q3.1 23.67,2.44 25.65,2.44 26.34,1.75 29.69,1.75 30.61,2.67 A1.23
CLK  (via drill 0.25)
  Top 0.152: v30.3,12.72 30.84,12.72 40.67,2.9 40.67,2.74 A1.31 | v29.62,12.04 29.62,12.27 27.18,14.71 13.54,14.71 11.63,12.8 JP6.5
  Bottom 0.152: v29.62,12.04 v30.3,12.72
CS  (via drill 0.25)
  Top 0.152: v32.66,8.99 33.35,8.99 39.37,2.97 39.37,2.74 A1.30 | v31.6,10.06 30.91,10.06 29.08,11.89 29.08,12.34 28.7,12.72 17.96,12.72 17.73,12.5 13.92,12.5 11.63,10.21 JP6.4
  Bottom 0.152: v31.6,10.06 v32.66,8.99
D+  (via drill 0.25)
  Top 0.152: 33.84,47.82 33.43,48.23 32.36,48.23 32.21,48.39 32.21,49.91 32.06,50.06 30.76,50.06 30.46,49.76 USB1.3 | 33.84,47.82 36.25,45.41 36.25,44.73 36.02,44.5 35.94,44.5 U4.2 | v33.05,47.02 31.52,47.02 30.53,46.02 30.53,45.57 U2.4 | 33.84,47.82 v33.96,47.93
  Bottom 0.152: v33.96,47.93 v33.05,47.02
D-
  Top 0.152: 31.41,47.51 31.06,47.85 31.06,49.07 USB1.2 | 31.41,47.51 31.44,47.47 31.75,47.47 31.83,47.55 33.2,47.55 33.58,47.17 33.58,45.03 35.03,43.59 35.56,43.59 35.79,43.81 35.79,43.89 U4.1 | 31.41,47.51 30,46.1 30,45.57 U2.5
DIN  (via drill 0.25)
  Top 0.152: v17.2,0.91 36.47,0.91 37.62,2.06 37.62,2.13 38.15,2.67 A1.29
  Bottom 0.152: v17.2,0.91 13.92,4.19 13.92,5.79 12.93,6.78 12.93,6.86 12.17,7.62 11.63,7.62 JP6.3
DTR  (via drill 0.25)
  Top 0.152: v37.47,36.73 37.47,40.54 33.35,44.65 32.82,44.65 U2.28 | v38.68,35.51 38.68,35.2 40.28,33.6 40.28,33.53 41.96,31.85 43.48,31.85 R4.2 | v37.92,34.82 37.39,34.29 37.39,29.64 37.77,29.26 38.99,29.26 40.51,27.74 41.05,27.74 Q2.2
  Bottom 0.152: v37.47,36.73 v38.68,35.51 38.61,35.51 v37.92,34.82
ECHO
  Top 0.152: R1.1 22.22,13.72 17.35,13.72 J3.3
ECHO3.3  (via drill 0.25)
  Top 0.152: R2.2 22.22,9.83 17.12,9.83 16.28,10.67 16.28,11.58 16.89,12.19 17.8,12.19 17.96,12.04 22.22,12.04 R1.2 22.3,12.04 22.45,12.19 v28.55,12.19 | v29.69,13.34 37.62,13.34 44.47,20.19 44.47,20.34 A1.5
  Bottom 0.152: v28.55,12.19 v29.69,13.34
EN
  Top 0.152: A1.3 46.99,20.42 46.99,20.57 43.1,24.46 43.1,24.61 Q1.3 43.1,26.21 45.39,28.5 45.39,29.03 45.77,29.41 46.08,29.41 47.45,30.79 C4.1 47.45,30.86 47.45,31.93 46.69,32.69 46.69,32.77 45.08,34.37 44.02,34.37 42.76,35.62 | 42.76,35.62 42.8,35.66 42.8,38.02 42.26,38.56 JP4.1 | 42.76,35.62 41.81,34.67 41.81,34.44 R3.1
GND  (via drill 0.35)  (287 unrouted)
  other vias: 17.3,34.65 27.4,36.49 27.26,32.76 34.75,45.75 32.8,46.23 49.89,32.49 49.26,28.21 46.94,29.03 45.66,25.72 40.27,30.7 38.53,32.98 35.84,33.15 39.92,27.09 34.12,23.78 33.72,31.49 32.71,34.29 30.37,33.73 32.69,30.5 19.77,15.41 24.27,8.3 20.57,8.44 19.79,6.94 14.64,10.94 14.21,13.65 14.69,7.48 11.88,16.09 26.69,10.43 29.96,8.9 31.82,4.86 34.6,5.42 32.81,12.03 37.82,11.57 49.43,0.97 47.57,0.97 45.85,1.02 43.43,1.02 41.93,0.99 40.31,1.02 38.64,1.14 49.53,5.08 49.53,6.35 49.53,7.62 49.53,8.89 49.53,10.16 49.53,11.43 49.53,12.7 49.53,13.97 49.53,15.24 49.53,16.51 49.53,17.78 42.1,15.92 43.53,16.28 46,15.75 46.04,17.81 46.17,13.23 46.12,12.1 47.69,13.11 47.67,10.62 45.78,9.34 36.03,14.32 36.54,17.74 41.23,17.95 39.44,16.72 32.74,17.69 33.87,16.77 34.07,14.03 30.73,13.89 26.45,13.5 34.53,10.48 23.84,17.99 30.04,17.38 36.9,27.09 39.96,24.09 40.75,21.84 32.75,27.75 31.73,26.13 31.88,24.56 33.15,24.74 33.01,23.2 33.94,22.27 25.12,22.85 19.75,23.16 16.59,23.21 27.63,23.01 23.16,27.22 21.41,27.53 20.45,28.83 24.32,28.88 22.41,29.28 11.28,23.16 9.89,25.33 8.45,26.48 6.52,10.61 2.55,9.05 3.03,6.09 4.83,4.04 6.7,1.57 1.27,12.7 1.27,15.24 1.27,16.51 1.27,17.78 1.27,19.05 1.27,20.32 1.27,21.59 1.27,22.86 1.27,24.13 1.27,25.4 1.27,26.67 1.27,27.94 1.27,31.75 1.27,33.02 26.7,41.95 26.44,40.7 34.31,39.44 21.84,43.46 22.47,46.51 27.94,46.99 26.67,46.99 21.59,49.53 22.86,50.8 24.13,49.53 20.32,52.07 20.32,50.8 20.32,48.26 25.4,48.26 35.56,48.26 36.83,48.26 38.1,48.26 39.37,49.53 40.64,50.8 41.91,50.8 41.91,48.26 40.64,46.99 39.37,45.72 39.37,44.45 40.64,44.45 40.64,43.18 39.37,43.18 39.37,41.91 40.64,41.91 36.83,52.07 54.61,31.75 54.61,33.02 55.88,33.02 55.88,38.1 54.61,38.1 53.34,39.37 53.34,43.18 53.34,45.72 53.34,49.53 39.37,52.07 41.91,52.07 10.16,50.8 10.16,49.53 8.89,49.53 10.16,44.45 1.27,48.26 6.35,48.26 12.7,38.1 13.97,36.83 15.24,35.56 12.7,35.56 15.24,38.1 10.16,29.21 10.16,30.48 13.97,25.4 15.24,25.4 17.78,25.4 12.7,25.4 12.7,20.32 11.43,20.32 22.86,20.32 24.2,21.08 24.66,20.24 24.75,18.52 22.6,18.73 26.17,18.55 30.64,18.75 8.89,16.51 10.87,18.52 19.07,18.52 14.01,21.17 10.18,21.21 8.28,21.17 9.8,23.42 13.81,23.63 12.8,22.8 15.22,23.67 14.94,22.78 5.31,16.53 13.97,16.51 15.24,16.51 41.91,6.35 40.64,7.62 41.91,8.89 40.64,10.16 38.99,13.38 38.88,9.41 37.42,10.04 36.1,12.2 43.52,5.16 43.63,9.2 21.49,32.45 23.16,32.52 19.26,32.45 1.27,40.64 6.35,40.64 8.89,40.64 1.27,35.56 8.89,34.29 8.89,31.75 22.86,35.56 22.76,37.77 20.34,37.77 17.37,37.77 25.53,43.32 21.41,42.33 29.74,39.79 31,39.17 32.44,37.89 35.01,37.75 35.56,34.29 43.16,23.61 43,22.34 43.76,26.07 45.71,23.11 46.7,22.24 49.5,22.53 48.84,25.97 43.15,34.35 46.38,49.9 46.69,46.68 46.39,48.78 36.38,37.19 36.34,39.6
  pour Bottom (isolate 0.203): 0,50.8 2.54,53.34 53.34,53.34 54.61,52.07 54.61,40.64 57.15,38.1 57.15,33.02 54.61,30.48 50.8,30.48 50.8,0 0,0
  pour Top (isolate 0.203, rank 2): 2.54,53.34 53.34,53.34 54.61,52.07 54.61,40.64 57.15,38.1 57.15,33.02 54.61,30.48 50.8,30.48 50.8,0 0,0 0,50.8
GPIO4
  Top 0.152: A1.26 34.34,2.67 33.81,2.13 33.81,2.06 33.2,1.45 10.57,1.45 4.78,7.24 4.78,31.62 6.07,32.92 JP1.2
GPIO12
  Top 0.152: A1.14 33.12,20.42 33.12,21.64 30.21,24.55 12,24.55 6.15,30.4 JP1.4
GPIO21  (via drill 0.25)
  Top 0.152: v33.35,12.8 43.18,2.97 43.18,2.74 A1.33 | v29.77,16.38 23.9,16.38 21.23,19.05 5.92,19.05 5.08,19.89 5.08,26.9 6.07,27.89 JP1.6
  Bottom 0.152: v29.77,16.38 v33.35,12.8
GPIO32  (via drill 0.25)
  Top 0.152: v34.87,19.28 39.75,19.28 40.67,20.19 40.67,20.34 A1.8 | v32.59,21.49 29.86,24.22 7.23,24.22 6.15,25.3 JP1.8
  Bottom 0.152: v34.87,19.28 32.66,21.49 v32.59,21.49
GPIO36  (via drill 0.25)
  Top 0.152: v40.06,23.24 40.28,23.01 43.26,23.01 45.24,21.03 45.24,20.95 45.77,20.42 A1.4 | v31.37,22.02 6.91,22.02 6.15,22.78 JP1.10
  Bottom 0.152: v40.06,23.24 40.06,22.63 38.53,21.11 33.66,21.11 32.74,22.02 v31.37,22.02
N$3
  Top 0.152: Q3.3 21.39,3.43 17.73,3.43 17.73,3.49 JP3.2
N$4
  Top 0.152: Q1.1 41.12,25.6 42.04,25.6 45.08,28.65 45.08,31.55 45.31,31.77 R4.1
N$5
  Top 0.152: Q2.1 41.05,29.57 38.99,29.57 38.38,30.18 R5.1
N$6
  Top 0.152: U2.9 28.09,44.12 21.69,44.12 21.01,44.81 R7.2
N$7
  Top 0.152: U2.8 28.09,44.73 24.28,44.73 24.21,44.81 R8.2 24.13,44.88 22.76,44.88 22,45.64 20.24,45.64 20.02,45.41 20.02,42.29 23.37,38.94 26.8,38.94 R9.1
N$11
  Top 1.016: D2.2 3.71,37.26 3.71,43.05 JP2.1
NOISE
  Top 0.152: A1.7 41.96,20.34 41.96,20.19 37.31,15.54 23.82,15.54 21.69,17.68 8.59,17.68 6.15,15.24 JP1.16
RTS
  Top 0.152: U2.24 32.82,42.67 33.27,42.67 33.58,42.37 33.58,41 31.22,38.63 30.15,38.63 30,38.48 30,35.28 31.98,33.3 33.96,33.3 37.08,30.18 37.08,29.49 38.15,28.42 38.3,28.42 R5.2 38.38,28.35 39.29,27.43 39.29,25.91 41.05,24.16 41.05,23.85 Q1.2
RXD  (via drill 0.25)
  Top 0.152: v36.93,37.95 36.93,40.08 33.35,43.66 32.82,43.66 U2.26 | v42.04,32.84 44.02,32.84 44.32,32.54 v44.32,28.57 | v44.63,18.14 44.63,2.82 44.55,2.74 A1.34
  Bottom 0.152: v42.04,32.84 v36.93,37.95 | v44.32,28.57 44.32,20.88 45.69,19.51 45.69,19.2 v44.63,18.14
SERVO1
  Top 0.152: A1.37 48.36,2.74 48.36,17.68 50.34,19.66 50.34,28.27 48.28,30.33 48.28,31.55 46.99,32.84 46.99,33.6 45.16,35.43 LL.1
SERVO2  (via drill 0.25)
  Top 0.152: v47.68,19.36 47.07,18.75 A1.36
  Bottom 0.152: v47.68,19.36 47.68,31.09 48.82,32.23 48.82,39.22 46.08,39.22 46.08,40.52 RL.1
SERVO3  (via drill 0.25)
  Top 0.152: v32.97,41.07 32.97,40.84 32.21,40.08 31.14,40.08 29.69,38.63 29.69,29.79 34.49,24.99 36.09,24.99 36.55,24.54 36.55,24.23 37.54,23.24 37.69,23.24 39.37,21.57 39.37,20.42 A1.9
  Bottom 0.152: v32.97,41.07 34.43,42.53 44.36,42.53 44.89,43.06 LF.1
SERVO4  (via drill 0.25)
  Top 0.152: v38.15,22.1 38.15,20.42 A1.10 | v48.21,32.31 48.21,32.92 49.05,33.76 49.05,51.21 48.21,52.05 44.47,52.05 44.02,51.59 44.02,45.72 44.11,45.63 RF.1
  Bottom 0.152: v38.15,22.1 38.15,23.09 47.37,32.31 v48.21,32.31
SERVO5  (via drill 0.25)
  Top 0.152: v36.93,22.1 36.93,20.42 A1.11 | v47.68,33.53 47.68,33.91 46.15,35.43 46.15,46.63 45.19,47.6 LA.1
  Bottom 0.152: v36.93,22.1 36.93,22.86 47.6,33.53 v47.68,33.53
SERVO6  (via drill 0.25)
  Top 0.152: v37.47,22.71 36.86,22.71 35.64,21.49 35.64,20.42 A1.12 | v47.68,32.84 48.74,33.91 48.74,35.56 48.74,51.05 48.06,51.74 46.15,51.74 45.16,50.75 RA.1
  Bottom 0.152: v37.47,22.71 37.47,22.86 47.45,32.84 v47.68,32.84
TRIG
  Top 0.152: A1.24 31.75,2.74 31.75,2.97 23.67,11.05 17.35,11.05 J3.2
TXD  (via drill 0.25)
  Top 0.152: v42.04,26.29 42.04,30.02 39.98,32.08 39.98,33.45 38.08,35.36 36.47,35.36 35.79,36.04 35.79,40.69 33.35,43.13 32.82,43.13 U2.25 | v45.16,19.36 45.16,3.5 45.77,2.9 45.77,2.74 A1.35
  Bottom 0.152: v42.04,26.29 42.04,22.48 v45.16,19.36
USBV+  (via drill 0.25)
  Top 0.152: 31.86,48.27 31.75,48.39 31.75,49.07 USB1.1 | 31.86,48.27 32.21,47.93 33.27,47.93 33.88,47.32 33.88,45.19 35.1,43.97 35.25,43.97 U4.6 | v22.91,45.41 24.13,46.63 R8.1 | v22.91,43.59 22.91,41.53 23.75,40.69 D1.2 | v31.6,48.01 31.86,48.27
  Bottom 0.152: v22.91,43.59 v22.91,45.41 23.29,45.8 29.39,45.8 v31.6,48.01
V+  (via drill 0.25)  (1 unrouted)
  Top 1.016: 17.8,42.22 17.8,48.84 C3.1 | 17.8,42.22 19.33,40.69 D1.1 | 8.89,37.26 8.13,37.26 D2.1 | 8.89,37.26 12.7,41.07 J1.+T 13.16,41.38 13.77,41.99 17.35,41.99 17.8,42.22 | LL.2 47.63,38.22 47.67,38.22 47.67,40.48 RL.2 47.68,41.01 47.68,43.02 LF.2 47.68,43.56 47.68,45.57 RF.2 47.68,46.11 47.68,48.12 LA.2 47.65,48.16 47.63,48.18 RA.2 | JP6.1 11.63,2.59 14.04,2.59 17.34,5.9 JP3.1 17.35,5.94 17.35,8.53 J3.1 | 34.11,29.18 35.1,30.18 35.48,30.18 R6.2 | 34.11,29.18 34.11,27.28 35.56,25.83 C1.1 | v31.44,29.11 33.66,29.11 34.11,29.18 | v30.38,28.04 27.25,31.17 19.94,31.17 U3.3 19.41,31.32 16.51,31.32 15.21,32.61 J2.6 14.76,32.54 12.7,32.54 J2.1 12.39,32.99 9.12,36.27 9.12,36.8 8.89,37.26
  Bottom 1.016: J3.1 17.35,8.61 18.72,8.61 30.15,20.04 30.15,27.58 v30.38,28.04 v31.44,29.11 41.96,29.11 47.52,34.67 47.52,34.98 47.6,35.05 47.6,35.43 LL.2
VSENSE
  Top 0.152: R6.1 35.56,28.42 35.56,27.28 37.31,25.53 37.31,24.92 38.23,24 R10.2 38.3,23.93 39.52,22.71 41.05,22.71 43.18,20.57 43.18,20.42 A1.6

### Text on the board
tNames: GND | + | Battery | EN | 4 | V+ | GND | 12 | 3.3V | 21 | GND | 32 | 36 | GND | BTN2 | BOOT | BTN1 | GND | Noise | GND | Echo | CLK | Trig | CS | V+ | DIN | GND | V+ | Buzzer | V+ | Buzzer
bNames: ESP32 / OTTO